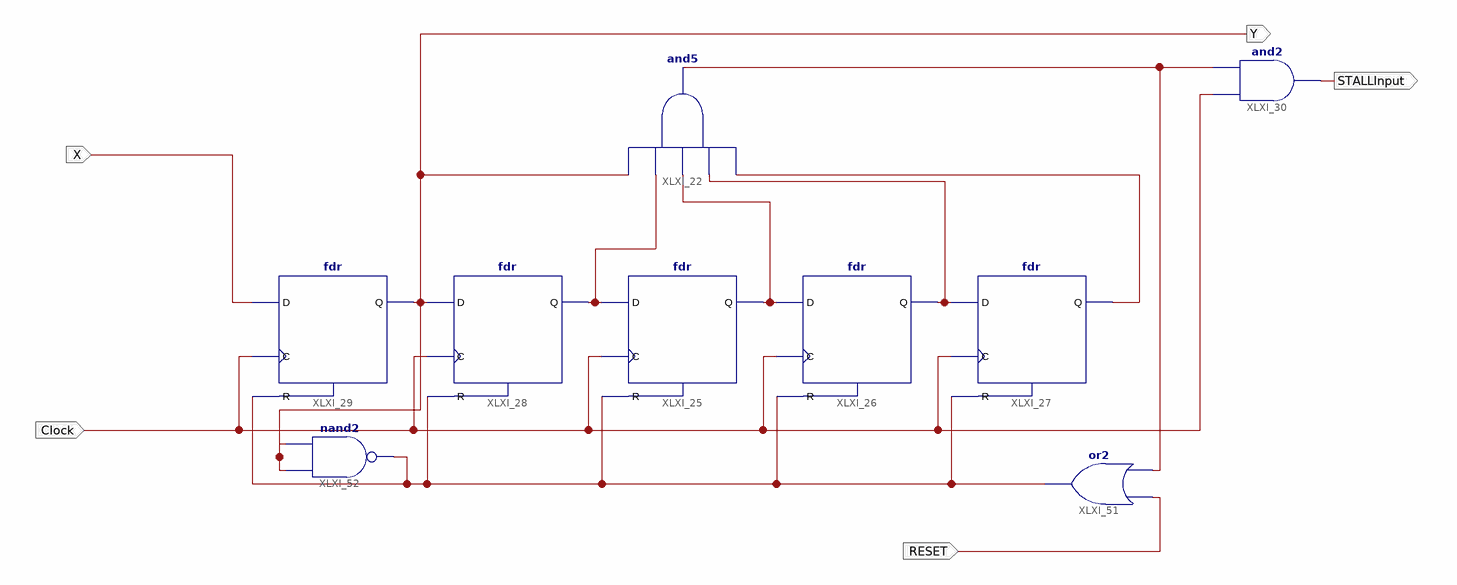
[diagram p0: schematic sheet 1]
// Xilinx ISE schematic courseProjectSchematic.sch (spartan3) as structural Verilog: 9 symbols, 5 ports
module courseProjectSchematic (
  input  Clock,
  input  X,
  input  RESET,
  output STALLInput,
  output Y
);

  wire XLXN_110, XLXN_112, XLXN_114, XLXN_116, XLXN_119, XLXN_130;

  and XLXI_22 (XLXN_119, XLXN_116, XLXN_114, XLXN_110, XLXN_112, Y);
  fdr #(.VeriModel("FDR")) XLXI_25 (.C(Clock), .D(XLXN_112), .R(XLXN_130), .Q(XLXN_110));
  fdr #(.VeriModel("FDR")) XLXI_26 (.C(Clock), .D(XLXN_110), .R(XLXN_130), .Q(XLXN_114));
  fdr #(.VeriModel("FDR")) XLXI_27 (.C(Clock), .D(XLXN_114), .R(XLXN_130), .Q(XLXN_116));
  fdr #(.VeriModel("FDR")) XLXI_28 (.C(Clock), .D(Y), .R(XLXN_130), .Q(XLXN_112));
  fdr #(.VeriModel("FDR"), .VhdlModel("FDR")) XLXI_29 (.C(Clock), .D(X), .R(XLXN_130), .Q(Y));
  and XLXI_30 (STALLInput, Clock, XLXN_119);
  or XLXI_51 (XLXN_130, XLXN_119, RESET);
  nand XLXI_52 (XLXN_130, Y, Y);
endmodule
